# Altium schematic sheet ProjectSheet.SchDoc
size A4; SheetNumber: 1; SheetTotal: 2
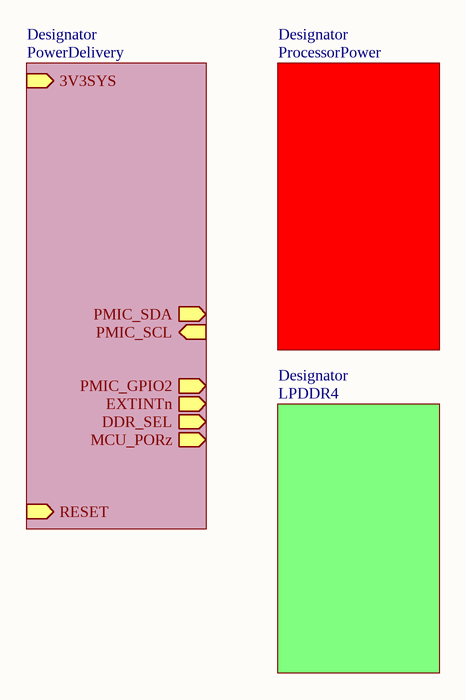
[diagram p0: ProjectSheet.SchDoc]

## Sub-sheets
Designator = PowerDelivery: PMIC_SDA (out), PMIC_SCL (in), 3V3SYS (in), PMIC_GPIO2 (out), EXTINTn (out), DDR_SEL (out), MCU_PORz (out), RESET (in)
Designator = LPDDR4: no entries
Designator = ProcessorPower: no entries